# Altium schematic sheet SAW_Ctrl.SchDoc
size A4; SheetNumber: 1; SheetTotal: 1
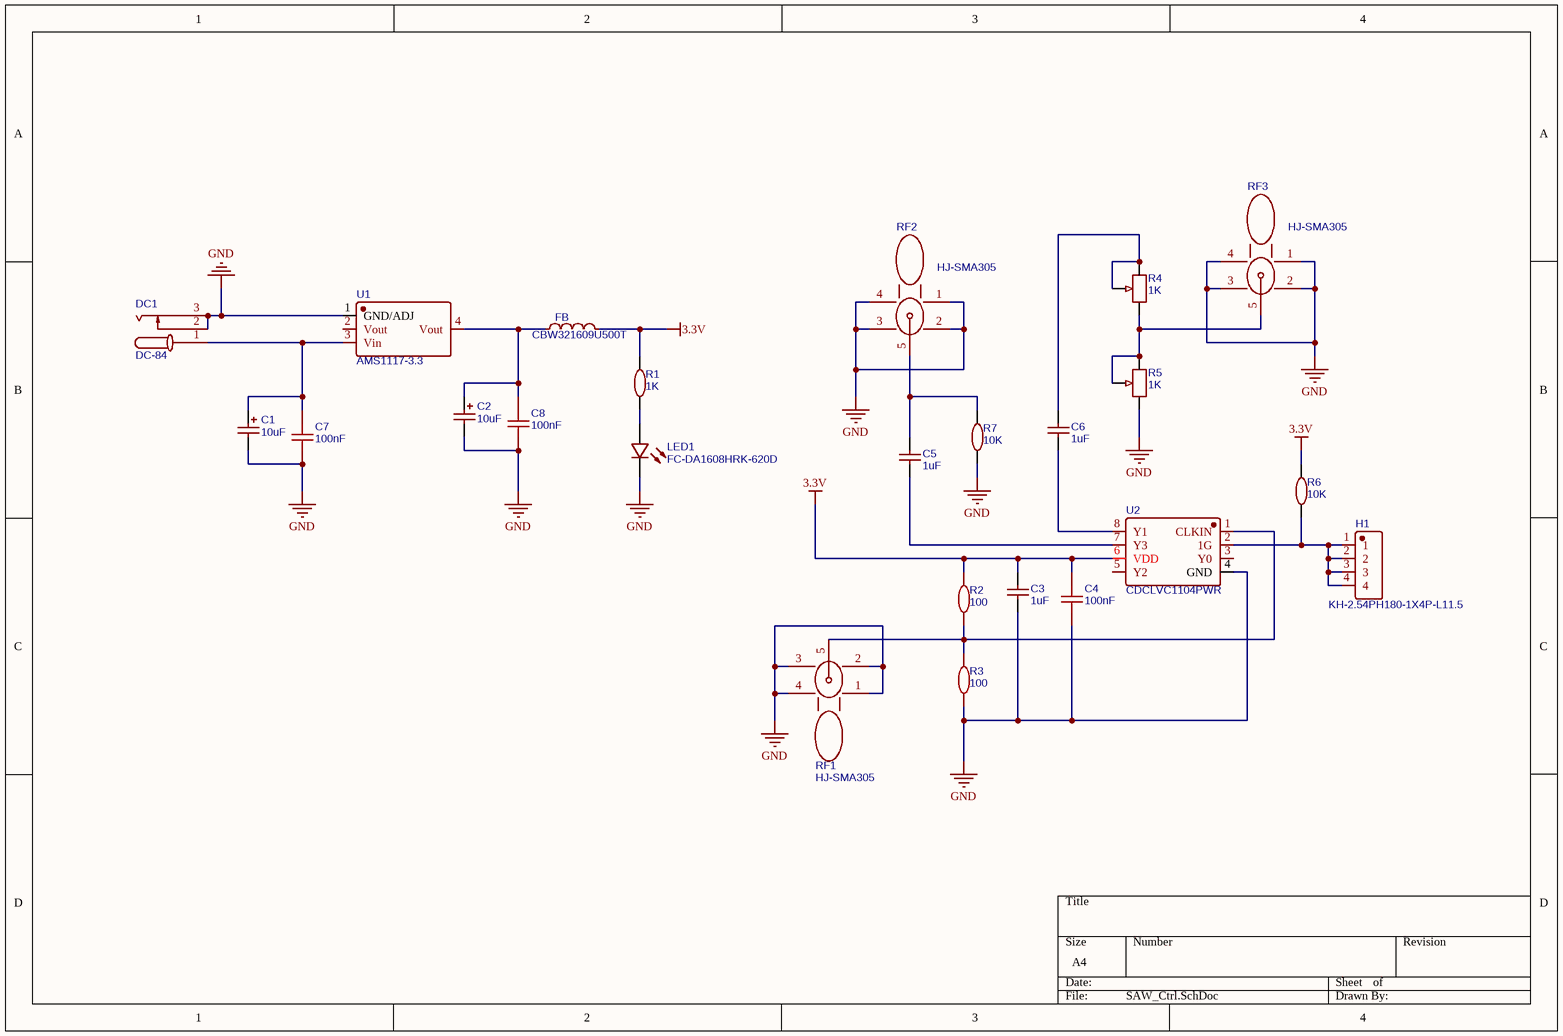
[diagram p0: SAW_Ctrl.SchDoc]

## Parts
C1  10uF  [CAP-SMD_L6.0-W3.2-R-RD]
C2  10uF  [CAP-SMD_L6.0-W3.2-R-RD]
C3  1uF  [C0603]
C4  100nF  [C0603]
C5  1uF  [C0603]
C6  1uF  [C0603]
C7  100nF  [C0603]
C8  100nF  [C0603]
DC1  DC-84  [DC-IN-TH_DC-84]
FB  CBW321609U500T  [L1206]
H1  KH-2.54PH180-1X4P-L11.5  [HDR-TH_4P-P2.54-V-M]
LED1  FC-DA1608HRK-620D  [LED0603-FD]
R1  1K  [R0805]
R2  100  [R0805]
R3  100  [R0805]
R4  1K  [RES-ADJ-TH_3P-L6.8-W6.8-P2.50-L_3323P]
R5  1K  [RES-ADJ-TH_3P-L6.8-W6.8-P2.50-L_3323P]
R6  10K  [R1206]
R7  10K  [R1206]
RF1  HJ-SMA305  [SMA-TH_BWSMA-KWE-Z001]
RF2  HJ-SMA305  [SMA-TH_BWSMA-KWE-Z001]
RF3  HJ-SMA305  [SMA-TH_BWSMA-KWE-Z001]
U1  AMS1117-3.3  [SOT-223-3_L6.5-W3.4-P2.30-LS7.0-BR]
U2  CDCLVC1104PWR  [TSSOP-8_L4.4-W3.0-P0.65-LS6.4-BL]

## Nets
3.3V: C3.2 C4.2 FB.2 R1.2 R2.2 R6.2 U2.6(VDD)
GND: C1.2 C2.2 C3.1 C4.1 C7.1 C8.1 DC1.2 DC1.3 LED1.2(K) R3.1 R5.1 R7.1 RF1.1 RF1.2 RF1.3 RF1.4 RF2.1 RF2.2 RF2.3 RF2.4 RF3.1 RF3.2 RF3.3 RF3.4 U1.1(GND/ADJ) U2.4(GND)
NetC1_1: C1.1 C7.2 DC1.1 U1.3(Vin)
NetC2_1: C2.1 C8.2 FB.1 U1.4(Vout)
NetC5_1: C5.1 U2.7(Y3)
NetC5_2: C5.2 R7.2 RF2.5
NetC6_1: C6.1 U2.8(Y1)
NetC6_2: C6.2 R4.2 R4.3
NetH1_1: H1.1 H1.2 H1.3 H1.4 R6.1 U2.2(1G)
NetLED1_1: LED1.1(A) R1.1
NetR2_1: R2.1 R3.2 RF1.5 U2.1(CLKIN)
NetR4_1: R4.1 R5.2 R5.3 RF3.5

Not connected (* = marked no-connect by the designer): U1 2(Vout); U2 3(Y0) 5(Y2)

## Library data of the parts
C1 C2 = 10uF_1: 钽电容10uF; BOM_Manufacturer: KEMET; BOM_Manufacturer Part: T491C106K025AT; nameAlias: Capacitance; BOM_Supplier: LCSC; BOM_Supplier Part: C116748; BOM_JLCPCB Part Class: Extended Part; spicePre: C; spiceSymbolName: T491C106K025AT
C3 C5 C6 = 1uF: 1uF电容; BOM_Manufacturer: FH; BOM_Manufacturer Part: 0603F105M160NT; nameAlias: Capacitance; BOM_Supplier: LCSC; BOM_Supplier Part: C1689; BOM_JLCPCB Part Class: Extended Part; spicePre: C; spiceSymbolName: 0603F105M160NT
C4 C7 C8 = 100nF: 100nF电容; BOM_Manufacturer: SAMSUNG; BOM_Manufacturer Part: CL10B104KC8NNNC; nameAlias: Capacitance; BOM_Supplier: LCSC; BOM_Supplier Part: C15725; BOM_JLCPCB Part Class: Extended Part; spicePre: C; spiceSymbolName: CL10B104KC8NNNC
DC1 = DC-84: 电源插头; BOM_Manufacturer: JINJIA(金佳); Contributor: LCSC; BOM_Supplier: LCSC; BOM_Supplier Part: C718040; BOM_Manufacturer Part: DC-84; spicePre: D; spiceSymbolName: DC-84
FB = CBW321609U500T: 磁珠50; BOM_Manufacturer: Guangdong Fenghua Advanced Tech; Contributor: LCSC; BOM_Supplier: LCSC; BOM_Supplier Part: C361673; BOM_Manufacturer Part: CBW321609U500T; BOM_JLCPCB Part Class: Extended Part; spicePre: U; spiceSymbolName: CBW321609U500T
H1 = KH-2.54PH180-1X4P-L11.5: 排针1*4; BOM_Manufacturer: kinghelm(金航标); Contributor: LCSC; BOM_Supplier: LCSC; BOM_Supplier Part: C2905435; BOM_Manufacturer Part: KH-2.54PH180-1X4P-L11.5; spicePre: H; spiceSymbolName: KH-2.54PH180-1X4P-L11.5
LED1 = FC-DA1608HRK-620D: led灯; BOM_Manufacturer: NATIONSTAR; BOM_Supplier: LCSC; BOM_Manufacturer Part: FC-DA1608HRK-620D; BOM_Supplier Part: C84263; BOM_JLCPCB Part Class: Extended Part; spicePre: L; spiceSymbolName: FC-DA1608HRK-620D
R1 = 1K: 电阻1K; BOM_Manufacturer: UniOhm; BOM_Manufacturer Part: 0805W8F1001T5E; nameAlias: Resistance (Ohms); BOM_Supplier: LCSC; BOM_Supplier Part: C17513; BOM_JLCPCB Part Class: Basic Part; spicePre: R; spiceSymbolName: 0805W8F1001T5E
R2 R3 = 100: 电阻100; BOM_Manufacturer: FH; BOM_Manufacturer Part: RS-05K101JT; nameAlias: Resistance (Ohms); Contributor: LCSC; BOM_Supplier: LCSC; BOM_Supplier Part: C115423; BOM_JLCPCB Part Class: Extended Part; spicePre: R; spiceSymbolName: RS-05K101JT
R4 R5 = 1K_1: 电位器1K; BOM_Manufacturer: Chengdu Guosheng Tech; BOM_Manufacturer Part: 3323P-1-102; nameAlias: Resistance (Ohms); Contributor: LCSC; BOM_Supplier: LCSC; BOM_Supplier Part: C118970; Resistance(Ohms): 1K; BOM_JLCPCB Part Class: Extended Part; spicePre: R; spiceSymbolName: 3323P-1-102
R6 R7 = 10K: 电阻10k; BOM_Manufacturer: FH; BOM_Manufacturer Part: RS-06K1002FT; nameAlias: Resistance (Ohms); BOM_Supplier: LCSC; BOM_Supplier Part: C140407; BOM_JLCPCB Part Class: Extended Part; spicePre: R; spiceSymbolName: RS-06K1002FT
RF1-RF3 = HJ-SMA305: SMA母口; BOM_Manufacturer: 皇捷; Contributor: LCSC; BOM_Supplier: LCSC; BOM_Supplier Part: C2693810; BOM_Manufacturer Part: HJ-SMA305; BOM_JLCPCB Part Class: Extended Part; spicePre: R; spiceSymbolName: HJ-SMA305
U1 = AMS1117-3.3: 降压芯片; BOM_Manufacturer: AMS; sourceId: dwIGgezVh; timeStamp: 1476261164; BOM_Supplier: LCSC; BOM_Manufacturer Part: AMS1117-3.3; BOM_Supplier Part: C6186; BOM_JLCPCB Part Class: Basic Part; spicePre: U; spiceSymbolName: AMS1117-3.3
U2 = CDCLVC1104PWR: 缓冲芯片; BOM_Manufacturer: Texas Instruments; Contributor: LCSC; BOM_Supplier: LCSC; BOM_Supplier Part: C485518; BOM_Manufacturer Part: CDCLVC1104PWR; BOM_JLCPCB Part Class: Extended Part; spicePre: U; spiceSymbolName: CDCLVC1104PWR